# EAGLE design hexapod (EAGLE 6.4)
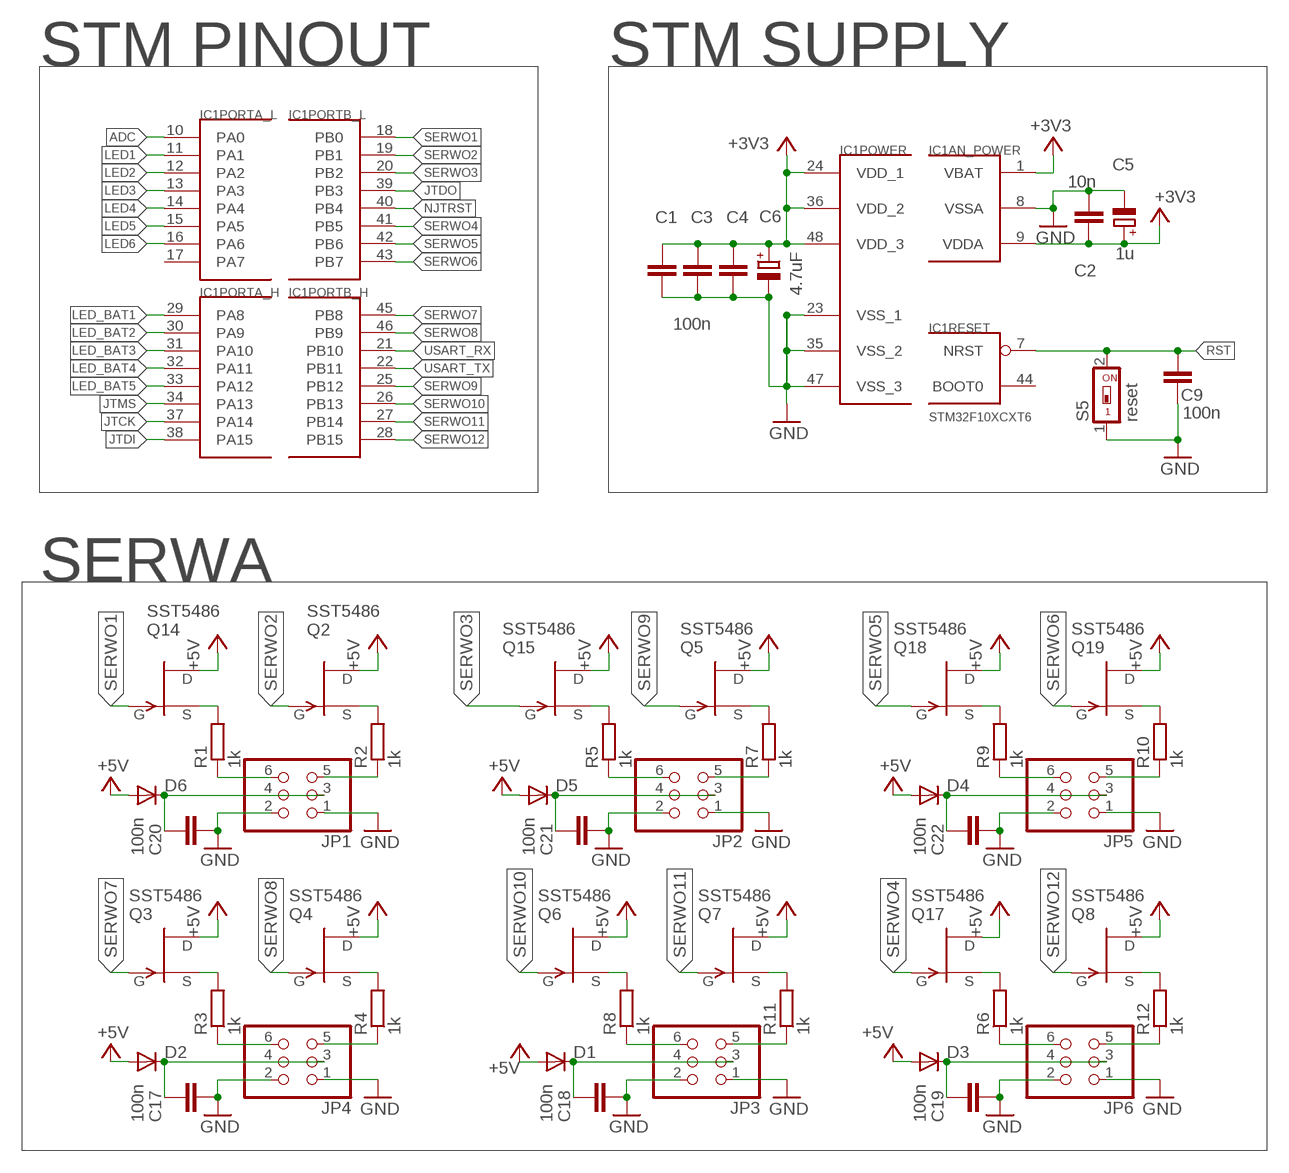
[diagram p0: schematic, sheet 1, part 1 of 2]
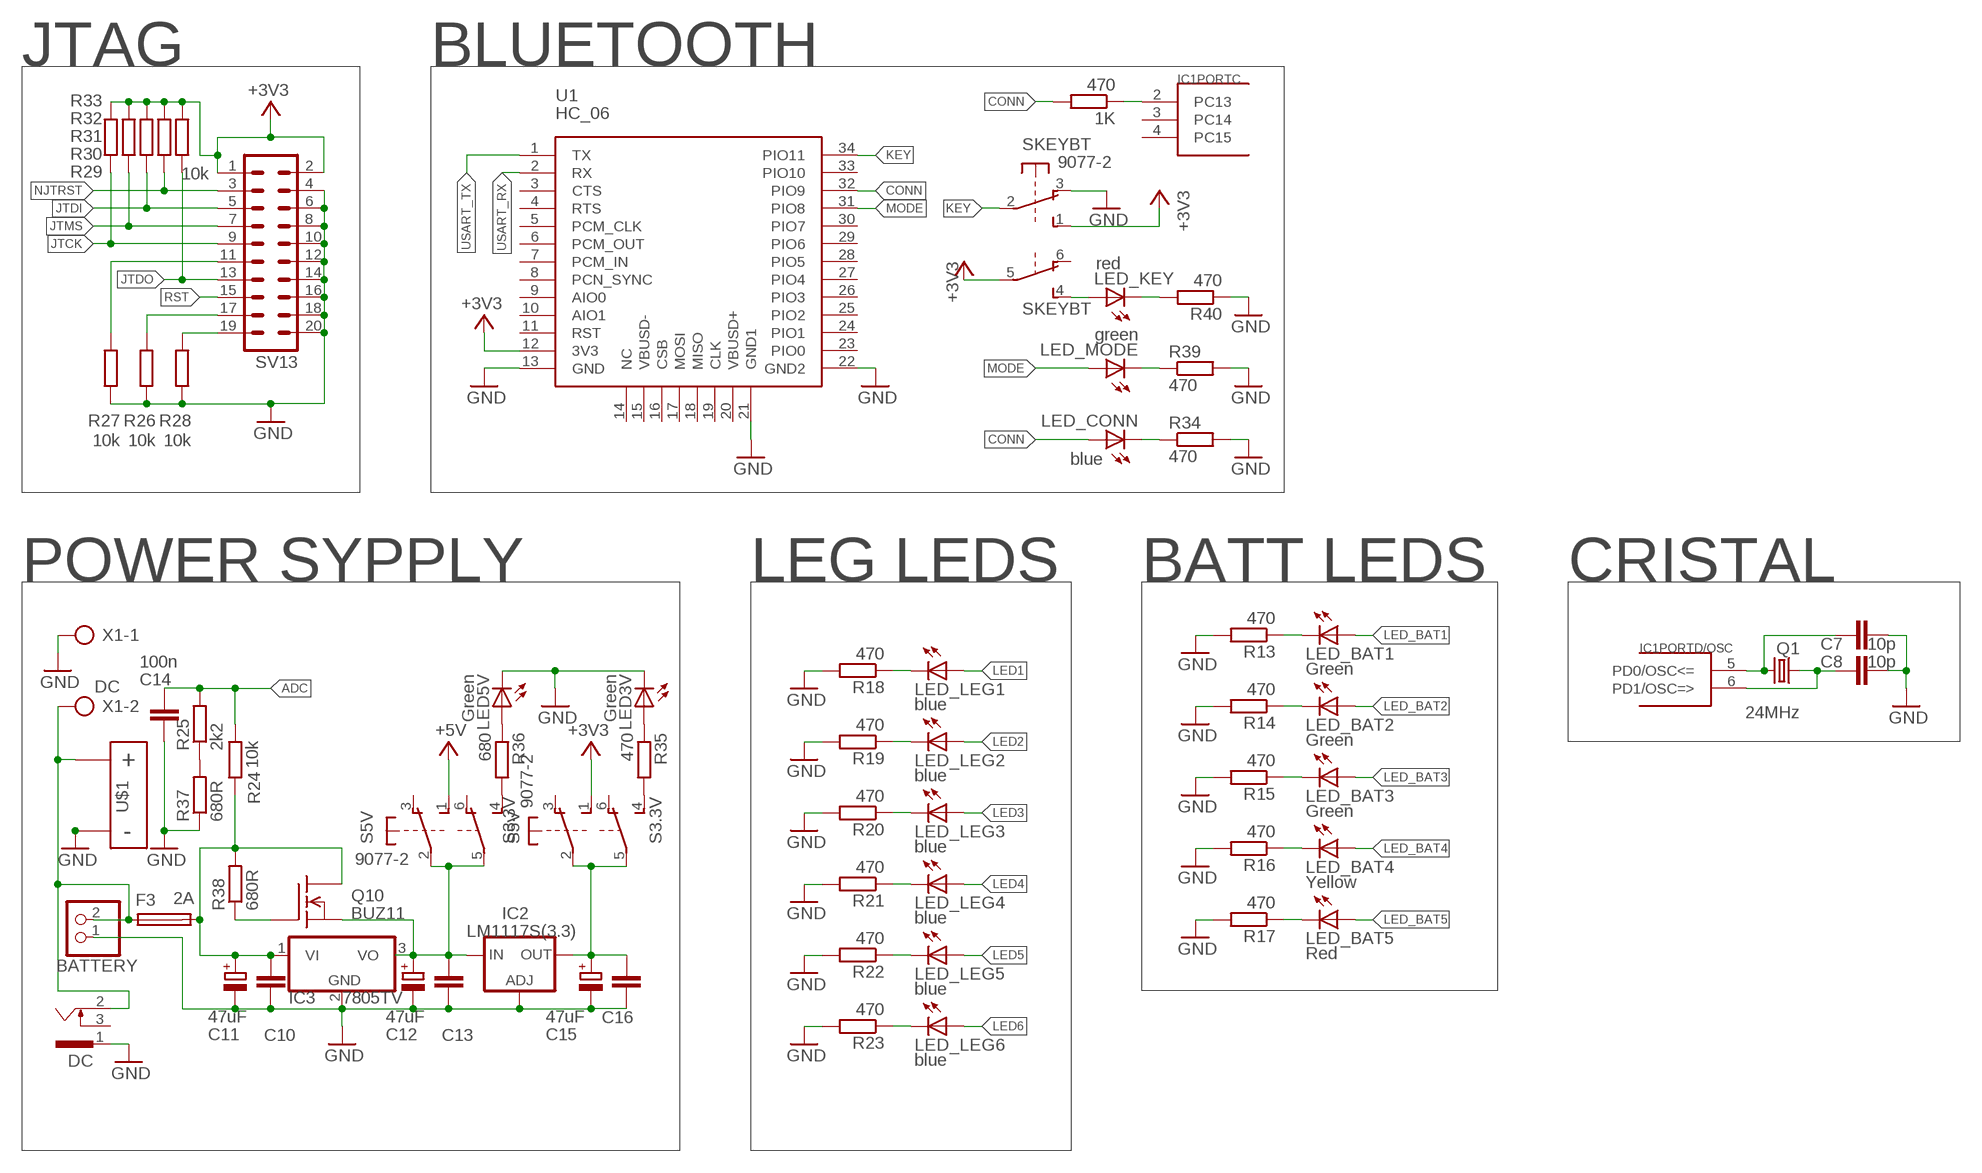
[diagram p1: schematic, sheet 1, part 2 of 2]

## Parts
1K  470  R-EU_M0805  [M0805]
BATTERY  PINHD-1X2  [1X02]
C1  100n  C-EUC0805K  [C0805K]
C2  10n  C-EUC0805K  [C0805K]
C3  100n  C-EUC0805K  [C0805K]
C4  100n  C-EUC0805K  [C0805K]
C5  1u  CPOL-EUE2.5-5  [E2,5-5]
C6  4.7uF  CPOL-EUE2.5-5  [E2,5-5]
C7  10p  C-EUC0805K  [C0805K]
C8  10p  C-EUC0805K  [C0805K]
C9  100n  C-EUC0805K  [C0805K]
C10  100n  C-EUC0805K  [C0805K]
C11  47uF  CPOL-EUE2.5-5  [E2,5-5]
C12  47uF  CPOL-EUE2.5-5  [E2,5-5]
C13  100n  C-EUC0805K  [C0805K]
C14  100n  C-EUC0805K  [C0805K]
C15  47uF  CPOL-EUE2.5-5  [E2,5-5]
C16  100n  C-EUC0805K  [C0805K]
C17  100n  C-EUC0805K  [C0805K]
C18  100n  C-EUC0805K  [C0805K]
C19  100n  C-EUC0805K  [C0805K]
C20  100n  C-EUC0805K  [C0805K]
C21  100n  C-EUC0805K  [C0805K]
C22  100n  C-EUC0805K  [C0805K]
D1  DIODE-DO-214AC  [DO-214AC]
D2  DIODE-DO-214AC  [DO-214AC]
D3  DIODE-DO-214AC  [DO-214AC]
D4  DIODE-DO-214AC  [DO-214AC]
D5  DIODE-DO-214AC  [DO-214AC]
D6  DIODE-DO-214AC  [DO-214AC]
DC  733980-62  [733980-62]
F3  2A  SH22,5  [SH22,5]
IC1  STM32F10XCXT6  [TQFP48]
IC2  LM1117S(3.3)  LM317MSTT3  [SOT223]
IC3  7805TV  [TO220V]
JP1  PINHD-2X3  [2X03]
JP2  PINHD-2X3  [2X03]
JP3  PINHD-2X3  [2X03]
JP4  PINHD-2X3  [2X03]
JP5  PINHD-2X3  [2X03]
JP6  PINHD-2X3  [2X03]
LED3V  Green  LEDCHIP-LED0805  [CHIP-LED0805]
LED5V  Green  LEDCHIP-LED0805  [CHIP-LED0805]
LED_BAT1  Green  LEDCHIP-LED0805  [CHIP-LED0805]
LED_BAT2  Green  LEDCHIP-LED0805  [CHIP-LED0805]
LED_BAT3  Green  LEDCHIP-LED0805  [CHIP-LED0805]
LED_BAT4  Yellow  LEDCHIP-LED0805  [CHIP-LED0805]
LED_BAT5  Red  LEDCHIP-LED0805  [CHIP-LED0805]
LED_CONN  blue  LEDCHIP-LED0805  [CHIP-LED0805]
LED_KEY  red  LEDCHIP-LED0805  [CHIP-LED0805]
LED_LEG1  blue  LEDCHIP-LED0805  [CHIP-LED0805]
LED_LEG2  blue  LEDCHIP-LED0805  [CHIP-LED0805]
LED_LEG3  blue  LEDCHIP-LED0805  [CHIP-LED0805]
LED_LEG4  blue  LEDCHIP-LED0805  [CHIP-LED0805]
LED_LEG5  blue  LEDCHIP-LED0805  [CHIP-LED0805]
LED_LEG6  blue  LEDCHIP-LED0805  [CHIP-LED0805]
LED_MODE  green  LEDCHIP-LED0805  [CHIP-LED0805]
Q1  24MHz  CRYSTALSM49  [SM49]
Q2  SST5486  [SOT23]
Q3  SST5486  [SOT23]
Q4  SST5486  [SOT23]
Q5  SST5486  [SOT23]
Q6  SST5486  [SOT23]
Q7  SST5486  [SOT23]
Q8  SST5486  [SOT23]
Q10  BUZ11  [TO220]
Q14  SST5486  [SOT23]
Q15  SST5486  [SOT23]
Q17  SST5486  [SOT23]
Q18  SST5486  [SOT23]
Q19  SST5486  [SOT23]
R1  1k  R-EU_M0805  [M0805]
R2  1k  R-EU_M0805  [M0805]
R3  1k  R-EU_M0805  [M0805]
R4  1k  R-EU_M0805  [M0805]
R5  1k  R-EU_M0805  [M0805]
R6  1k  R-EU_M0805  [M0805]
R7  1k  R-EU_M0805  [M0805]
R8  1k  R-EU_M0805  [M0805]
R9  1k  R-EU_M0805  [M0805]
R10  1k  R-EU_M0805  [M0805]
R11  1k  R-EU_M0805  [M0805]
R12  1k  R-EU_M0805  [M0805]
R13  470  R-EU_M0805  [M0805]
R14  470  R-EU_M0805  [M0805]
R15  470  R-EU_M0805  [M0805]
R16  470  R-EU_M0805  [M0805]
R17  470  R-EU_M0805  [M0805]
R18  470  R-EU_M0805  [M0805]
R19  470  R-EU_M0805  [M0805]
R20  470  R-EU_M0805  [M0805]
R21  470  R-EU_M0805  [M0805]
R22  470  R-EU_M0805  [M0805]
R23  470  R-EU_M0805  [M0805]
R24  10k  R-EU_M0805  [M0805]
R25  2k2  R-EU_M0805  [M0805]
R26  10k  R-EU_M0805  [M0805]
R27  10k  R-EU_M0805  [M0805]
R28  10k  R-EU_M0805  [M0805]
R29  10k  R-EU_M0805  [M0805]
R30  10k  R-EU_M0805  [M0805]
R31  10k  R-EU_M0805  [M0805]
R32  10k  R-EU_M0805  [M0805]
R33  10k  R-EU_M0805  [M0805]
R34  470  R-EU_M0805  [M0805]
R35  470  R-EU_M0805  [M0805]
R36  680  R-EU_M0805  [M0805]
R37  680R  R-EU_M0805  [M0805]
R38  680R  R-EU_M0805  [M0805]
R39  470  R-EU_M0805  [M0805]
R40  470  R-EU_M0805  [M0805]
S3.3V  9077-2  [9077-2]
S5  reset  SWS001  [SMS-001]
S5V  9077-2  [9077-2]
SKEYBT  9077-2  [9077-2]
SV13  ML20  [ML20]
U1  HC_06  HC_05  [BLUETOOTH_SMD]
U$1  DEANS.MALE  [DEANSM]
X1  DC  AK500/2  [AK500/2]

## Nets
+3V3: C1.1 C2.1 C3.1 C4.1 C5.+ C6.+ IC1.1(AN_POWER:VBAT) IC1.9(AN_POWER:VDDA) IC1.24(POWER:VDD_1) IC1.36(POWER:VDD_2) IC1.48(POWER:VDD_3) R29.2 R30.2 R31.2 R32.2 R33.2 S3.3V.1(1:S) SKEYBT.1(1:S) SKEYBT.5(2:P) SV13.1 SV13.2 U1.12(3V3)
+5V: D1.A D2.A D3.A D4.A D5.A D6.A Q2.1(D) Q3.1(D) Q4.1(D) Q5.1(D) Q6.1(D) Q7.1(D) Q8.1(D) Q14.1(D) Q15.1(D) Q17.1(D) Q18.1(D) Q19.1(D) S5V.1(1:S)
ADC: C14.1 IC1.10(PORTA_L:PA0) R24.1 R25.2
CONN: 1K.2 LED_CONN.A U1.32(PIO9)
GND: BATTERY.1 C1.2 C2.2 C3.2 C4.2 C5.- C6.- C7.2 C8.2 C9.1 C10.2 C11.- C12.- C13.2 C14.2 C15.- C16.2 C17.2 C18.2 C19.2 C20.2 C21.2 C22.2 DC.1 IC1.8(AN_POWER:VSSA) IC1.23(POWER:VSS_1) IC1.35(POWER:VSS_2) IC1.47(POWER:VSS_3) IC2.1(ADJ) IC3.2(GND) JP1.1 JP1.2 JP2.1 JP2.2 JP3.1 JP3.2 JP4.1 JP4.2 JP5.1 JP5.2 JP6.1 JP6.2 LED3V.C LED5V.C R13.2 R14.2 R15.2 R16.2 R17.2 R18.2 R19.2 R20.2 R21.2 R22.2 R23.2 R26.1 R27.1 R28.1 R34.2 R37.1 R39.2 R40.1 S5.1 SKEYBT.3(1:O) SV13.4 SV13.6 SV13.8 SV13.10 SV13.12 SV13.14 SV13.16 SV13.18 SV13.20 U1.13(GND) U1.21(GND1) U1.22(GND2) U$1.P$NEG X1.1
JTCK: IC1.37(PORTA_H:PA14) R29.1 SV13.9
JTDI: IC1.38(PORTA_H:PA15) R31.1 SV13.5
JTDO: IC1.39(PORTB_L:PB3) R33.1 SV13.13
JTMS: IC1.34(PORTA_H:PA13) R30.1 SV13.7
KEY: SKEYBT.2(1:P) U1.34(PIO11)
LED1: IC1.11(PORTA_L:PA1) LED_LEG1.A
LED2: IC1.12(PORTA_L:PA2) LED_LEG2.A
LED3: IC1.13(PORTA_L:PA3) LED_LEG3.A
LED4: IC1.14(PORTA_L:PA4) LED_LEG4.A
LED5: IC1.15(PORTA_L:PA5) LED_LEG5.A
LED6: IC1.16(PORTA_L:PA6) LED_LEG6.A
LED_BAT1: IC1.29(PORTA_H:PA8) LED_BAT1.A
LED_BAT2: IC1.30(PORTA_H:PA9) LED_BAT2.A
LED_BAT3: IC1.31(PORTA_H:PA10) LED_BAT3.A
LED_BAT4: IC1.32(PORTA_H:PA11) LED_BAT4.A
LED_BAT5: IC1.33(PORTA_H:PA12) LED_BAT5.A
MODE: LED_MODE.A U1.31(PIO8)
N$1: C7.1 IC1.5(PORTD/OSC:PD0/OSC<=) Q1.2
N$2: C8.1 IC1.6(PORTD/OSC:PD1/OSC=>) Q1.1
N$3: 1K.1 IC1.2(PORTC:PC13)
N$4: Q14.2(S) R1.2
N$5: JP5.5 R10.1
N$6: Q2.2(S) R2.2
N$7: JP3.5 R11.1
N$8: JP5.6 R9.1
N$9: JP3.6 R8.1
N$10: R25.1 R37.2
N$11: JP6.5 R12.1
N$12: Q15.2(S) R5.2
N$13: JP2.5 R7.1
N$14: Q18.2(S) R9.2
N$15: JP2.6 R5.1
N$16: JP6.6 R6.1
N$17: JP1.6 R1.1
N$18: JP4.6 R3.1
N$19: JP4.5 R4.1
N$20: Q19.2(S) R10.2
N$21: JP1.5 R2.1
N$22: R36.2 S5V.4(2:S)
N$23: C10.1 C11.+ F3.2 IC3.1(VI) Q10.2(D) R24.2 R38.2
N$24: Q10.1(G) R38.1
N$25: LED_MODE.C R39.1
N$26: LED_KEY.A SKEYBT.4(2:S)
N$27: LED_KEY.C R40.2
N$28: LED_BAT1.C R13.1
N$29: LED_LEG1.C R18.1
N$30: LED_BAT2.C R14.1
N$31: LED_LEG2.C R19.1
N$32: LED_BAT3.C R15.1
N$33: LED_LEG3.C R20.1
N$34: LED_BAT4.C R16.1
N$35: LED_LEG4.C R21.1
N$36: LED_BAT5.C R17.1
N$37: LED_LEG5.C R22.1
N$38: LED_LEG6.C R23.1
N$39: C18.1 D1.C JP3.3 JP3.4
N$40: LED_CONN.C R34.1
N$41: C15.+ C16.1 IC2.4(OUT) S3.3V.2(1:P) S3.3V.5(2:P)
N$42: C12.+ C13.1 IC2.3(IN) IC3.3(VO) Q10.3(S) S5V.2(1:P) S5V.5(2:P)
N$43: Q17.2(S) R6.2
N$44: R27.2 SV13.11
N$45: Q3.2(S) R3.2
N$46: R35.2 S3.3V.4(2:S)
N$47: R26.2 SV13.17
N$48: R28.2 SV13.19
N$49: LED3V.A R35.1
N$50: C17.1 D2.C JP4.3 JP4.4
N$51: LED5V.A R36.1
N$52: BATTERY.2 DC.2 F3.1 U$1.P$POS X1.2
N$53: Q4.2(S) R4.2
N$54: Q5.2(S) R7.2
N$55: Q6.2(S) R8.2
N$56: Q7.2(S) R11.2
N$57: Q8.2(S) R12.2
N$58: C19.1 D3.C JP6.3 JP6.4
N$59: C22.1 D4.C JP5.3 JP5.4
N$60: C21.1 D5.C JP2.3 JP2.4
N$61: C20.1 D6.C JP1.3 JP1.4
NJTRST: IC1.40(PORTB_L:PB4) R32.1 SV13.3
RST: C9.2 IC1.7(RESET:NRST) S5.2 SV13.15
SERWO1: IC1.18(PORTB_L:PB0) Q14.3(G)
SERWO2: IC1.19(PORTB_L:PB1) Q2.3(G)
SERWO3: IC1.20(PORTB_L:PB2) Q15.3(G)
SERWO4: IC1.41(PORTB_L:PB5) Q17.3(G)
SERWO5: IC1.42(PORTB_L:PB6) Q18.3(G)
SERWO6: IC1.43(PORTB_L:PB7) Q19.3(G)
SERWO7: IC1.45(PORTB_H:PB8) Q3.3(G)
SERWO8: IC1.46(PORTB_H:PB9) Q4.3(G)
SERWO9: IC1.25(PORTB_H:PB12) Q5.3(G)
SERWO10: IC1.26(PORTB_H:PB13) Q6.3(G)
SERWO11: IC1.27(PORTB_H:PB14) Q7.3(G)
SERWO12: IC1.28(PORTB_H:PB15) Q8.3(G)
USART_RX: IC1.21(PORTB_H:PB10) U1.2(RX)
USART_TX: IC1.22(PORTB_H:PB11) U1.1(TX)
Unconnected: DC.3 IC1.3(PORTC:PC14) IC1.4(PORTC:PC15) IC1.17(PORTA_L:PA7) IC1.44(RESET:BOOT0) S3.3V.3(1:O) S3.3V.6(2:O) S5V.3(1:O) S5V.6(2:O) SKEYBT.6(2:O) U1.3(CTS) U1.4(RTS) U1.5(PCM_CLK) U1.6(PCM_OUT) U1.7(PCM_IN) U1.8(PCN_SYNC) U1.9(AIO0) U1.10(AIO1) U1.11(RST) U1.14(NC) U1.15(VBUSD-) U1.16(CSB) U1.17(MOSI) U1.18(MISO) U1.19(CLK) U1.20(VBUSD+) U1.23(PIO0) U1.24(PIO1) U1.25(PIO2) U1.26(PIO3) U1.27(PIO4) U1.28(PIO5) U1.29(PIO6) U1.30(PIO7) U1.33(PIO10)

## Notes on the sheet
- STM PINOUT | STM SUPPLY | JTAG | BLUETOOTH
- SERWA | POWER SYPPLY | LEG LEDS | BATT LEDS | CRISTAL

## Library data of the parts
1K R1-R40 = resistor:R-EU_: RESISTOR, European symbol
BATTERY = pinhead:PINHD-1X2: PIN HEADER
C1-C4 C7-C10 C13 C14 C16-C22 = rcl:C-EU: CAPACITOR, European symbol
C5 C6 C11 C12 C15 = rcl:CPOL-EU: POLARIZED CAPACITOR, European symbol
D1-D6 = diode:DIODE-: DIODE
DC = con-conrad:73398?: FEMALE PRINT CONNECTOR Niedervolt-Steckverbinder Distributor Conrad
F3 = fuse:SH22,5: FUSE HOLDER grid 22,5 mm, OGN0031 8201, Schurter (Buerklin); MF: SCHURTER; MPN: 0031.8201; OC_FARNELL: 1162740; OC_NEWARK: 96F8317
IC1 = stm32:STM32F10XCXT6: ST STM32F101/103 48pin LQFP
IC2 = v-reg:LM317?*: 500 mA Adjustable Output Positive Voltage Regulator Source: http://www.onsemi.co.jp .. LM317M-D.PDF
IC3 = linear:78*: Positive VOLTAGE REGULATOR Source: http://cache.national.com/ds/LM/LM78L05.pdf http://www.fairchildsemi.com/ds/LM/LM7805.pdf
JP1-JP6 = pinhead:PINHD-2X3: PIN HEADER
LED3V LED5V LED_BAT1-LED_BAT5 LED_CONN LED_KEY LED_LEG1-LED_LEG6 LED_MODE = led:LED: LED OSRAM: - CHIPLED LG R971, LG N971, LY N971, LG Q971, LY Q971, LO R971, LY R971 LH N974, LH R974 LS Q976, LO Q976, LY Q976 LO Q996 - Hyper CHIPLED LW Q18S LB Q993, LB Q99A, LB R99A - SideLED LS A670, LO A670, LY A670, LG A670, LP A670 LB A673, LV A673, LT A673, LW A673 LH A674 LY A675 LS A676, LA A676, LO A676, LY A676, LW A676 LS A679, LY A679, LG A679 - Hyper Micro SIDELED® LS Y876, LA Y876, LO Y876, LY Y876 LT Y87S - SmartLED LW L88C, LW L88S LB L89C, LB L89S, LG L890 LS L89K, LO L89K, LY L89K LS L896, LA L896, LO L896, LY L896 - TOPLED LS T670, LO T670, LY T670, LG T670, LP T670 LSG T670, LSP T670, LSY T670, LOP T670, LYG T670 LG T671, LOG T671, LSG T671 LB T673, LV T673, LT T673, LW T673 LH T674 LS T676, LA T676, LO T676, LY T676, LB T676, LH T676, LSB T676, LW T676 LB T67C, LV T67C, LT T67C, LS T67K, LO T67K, LY T67K, LW E67C LS E67B, LA E67B, LO E67B, LY E67B, LB E67C, LV E67C, LT E67C LW T67C LS T679, LY T679, LG T679 LS T770, LO T770, LY T770, LG T770, LP T770 LB T773, LV T773, LT T773, LW T773 LH T774 LS E675, LA E675, LY E675, LS T675 LS T776, LA T776, LO T776, LY T776, LB T776 LHGB T686 LT T68C, LB T68C - Hyper Mini TOPLED® LB M676 - Mini TOPLED Santana® LG M470 LS M47K, LO M47K, LY M47K Source: http://www.osram.convergy.de LUXEON: - LUMILED® LXK2-PW12-R00, LXK2-PW12-S00, LXK2-PW14-U00, LXK2-PW14-V00 LXK2-PM12-R00, LXK2-PM12-S00, LXK2-PM14-U00 LXK2-PE12-Q00, LXK2-PE12-R00, LXK2-PE12-S00, LXK2-PE14-T00, LXK2-PE14-U00 LXK2-PB12-K00, LXK2-PB12-L00, LXK2-PB12-M00, LXK2-PB14-N00, LXK2-PB14-P00, LXK2-PB14-Q00 LXK2-PR12-L00, LXK2-PR12-M00, LXK2-PR14-Q00, LXK2-PR14-R00 LXK2-PD12-Q00, LXK2-PD12-R00, LXK2-PD12-S00 LXK2-PH12-R00, LXK2-PH12-S00 LXK2-PL12-P00, LXK2-PL12-Q00, LXK2-PL12-R00 Source: www.luxeon.com KINGBRIGHT: KA-3528ASYC Source: www.kingbright.com
Q1 = crystal:CRYSTAL: CRYSTAL; OC_FARNELL: unknown; OC_NEWARK: unknown
Q2-Q8 Q14 Q15 Q17-Q19 = transistor-fet:?548*: N-Channel JFETs Source: VISHAY 2N5484.pdf Compatible: TO92 2N5245 J304 J305 U310 J308 J309 J310 TO72 2N4416 2N4416A 2N3823 2N4351 3N169 3N170 3N171 MFE3002 TO18 2N3796 2N3797 MFE825 Source: Motorola European Master Guide Pacge 3-59
Q10 = transistor-fet:BUZ11: N-Channel Enhancement MOSFET 50V; 30A; 0,040Ohm
S3.3V S5V SKEYBT = switch-misc:9077-2: MARQUARDT SWITCH 9077.0200 Distributor: Buerklin <https://www.buerklin.com/default.asp?event=ShowArtikel%2812G2822%29&l=d&jump=ArtNr_12G2822>
S5 = smd-special:SWS001: SMD Dip Switch 1 pol.
SV13 = con-harting-ml:ML20: HARTING; OC_FARNELL: unknown; OC_NEWARK: unknown
U1 = SerialPortBluetooth:HC_05
U$1 = bt_electromech:DEANS
X1 = con-ptr500:AK500/2: CONNECTOR; OC_FARNELL: unknown; OC_NEWARK: unknown

## Board
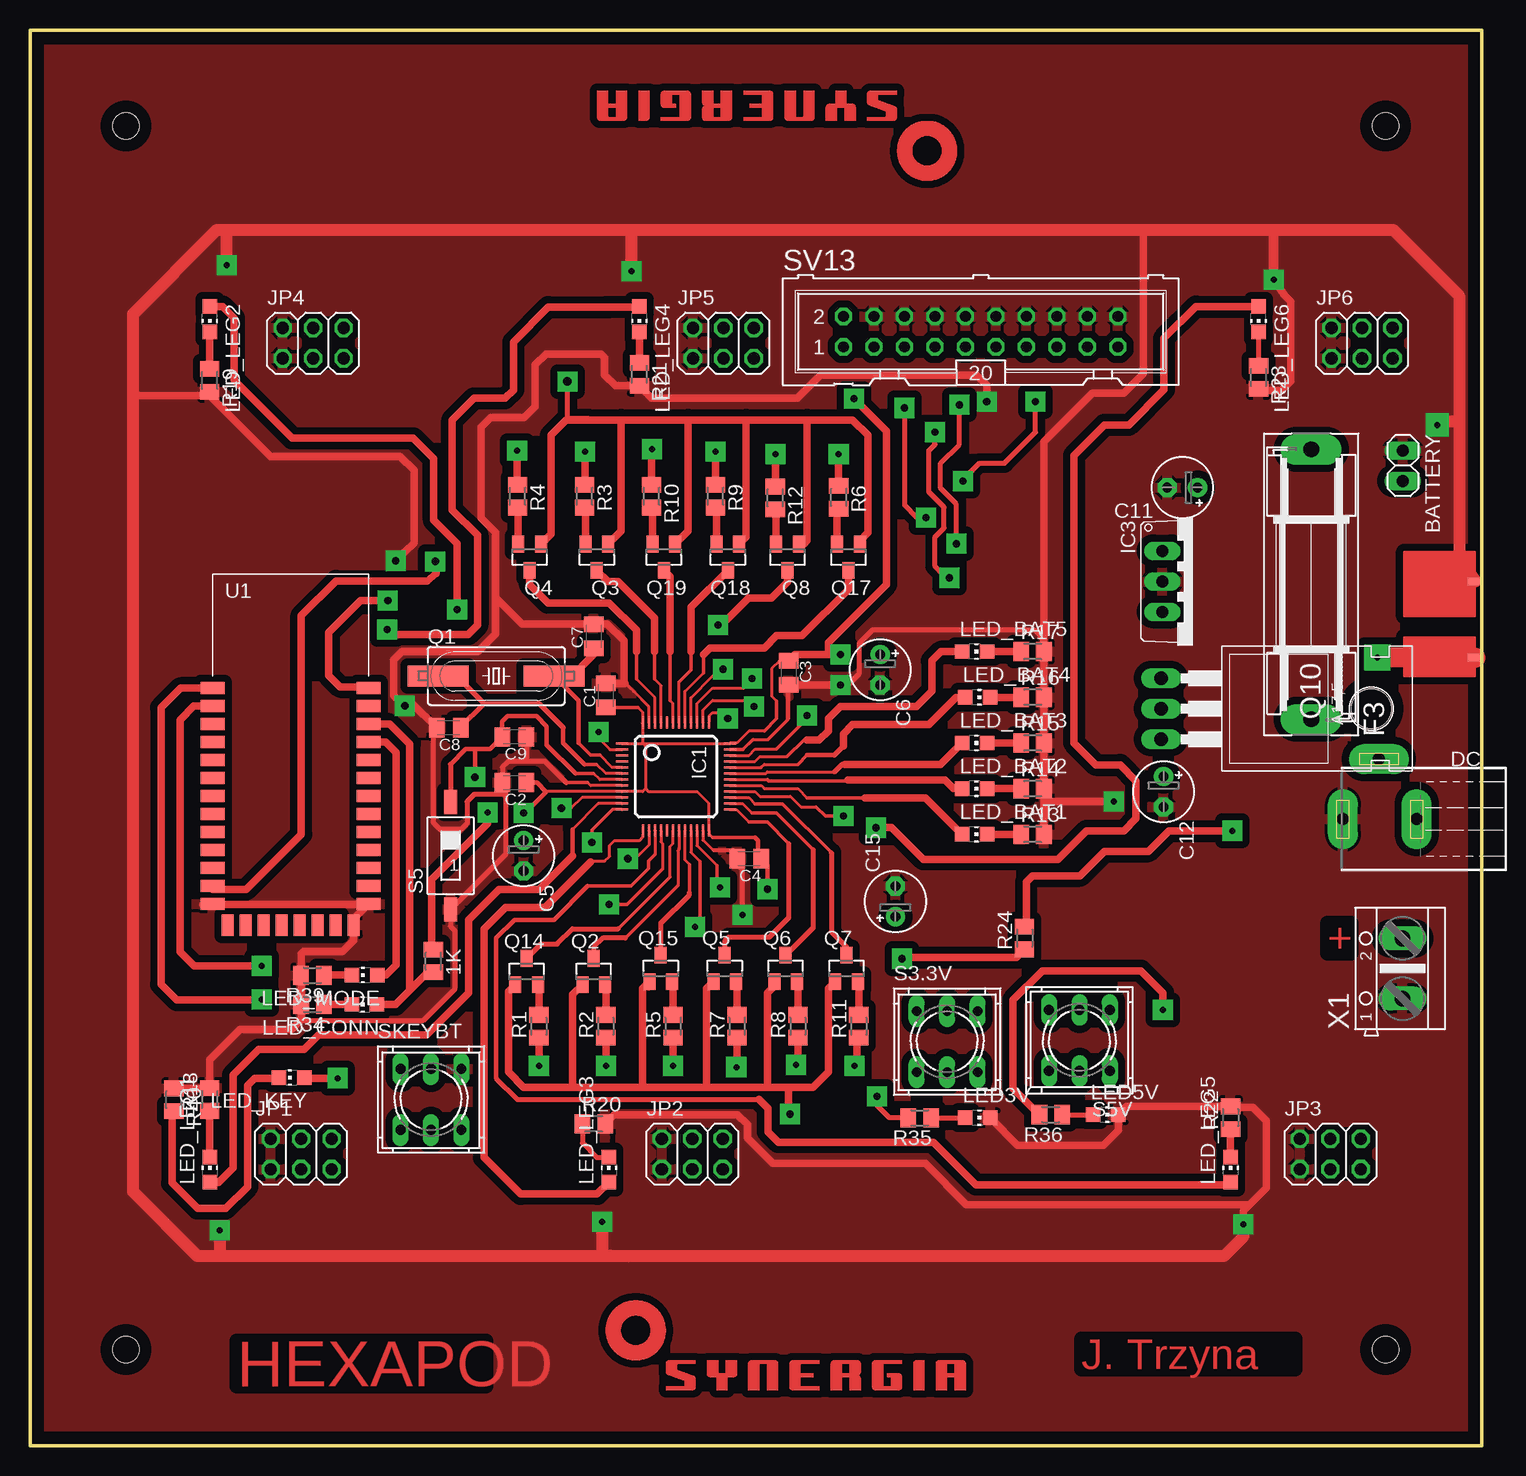
[diagram p2: board, top side]
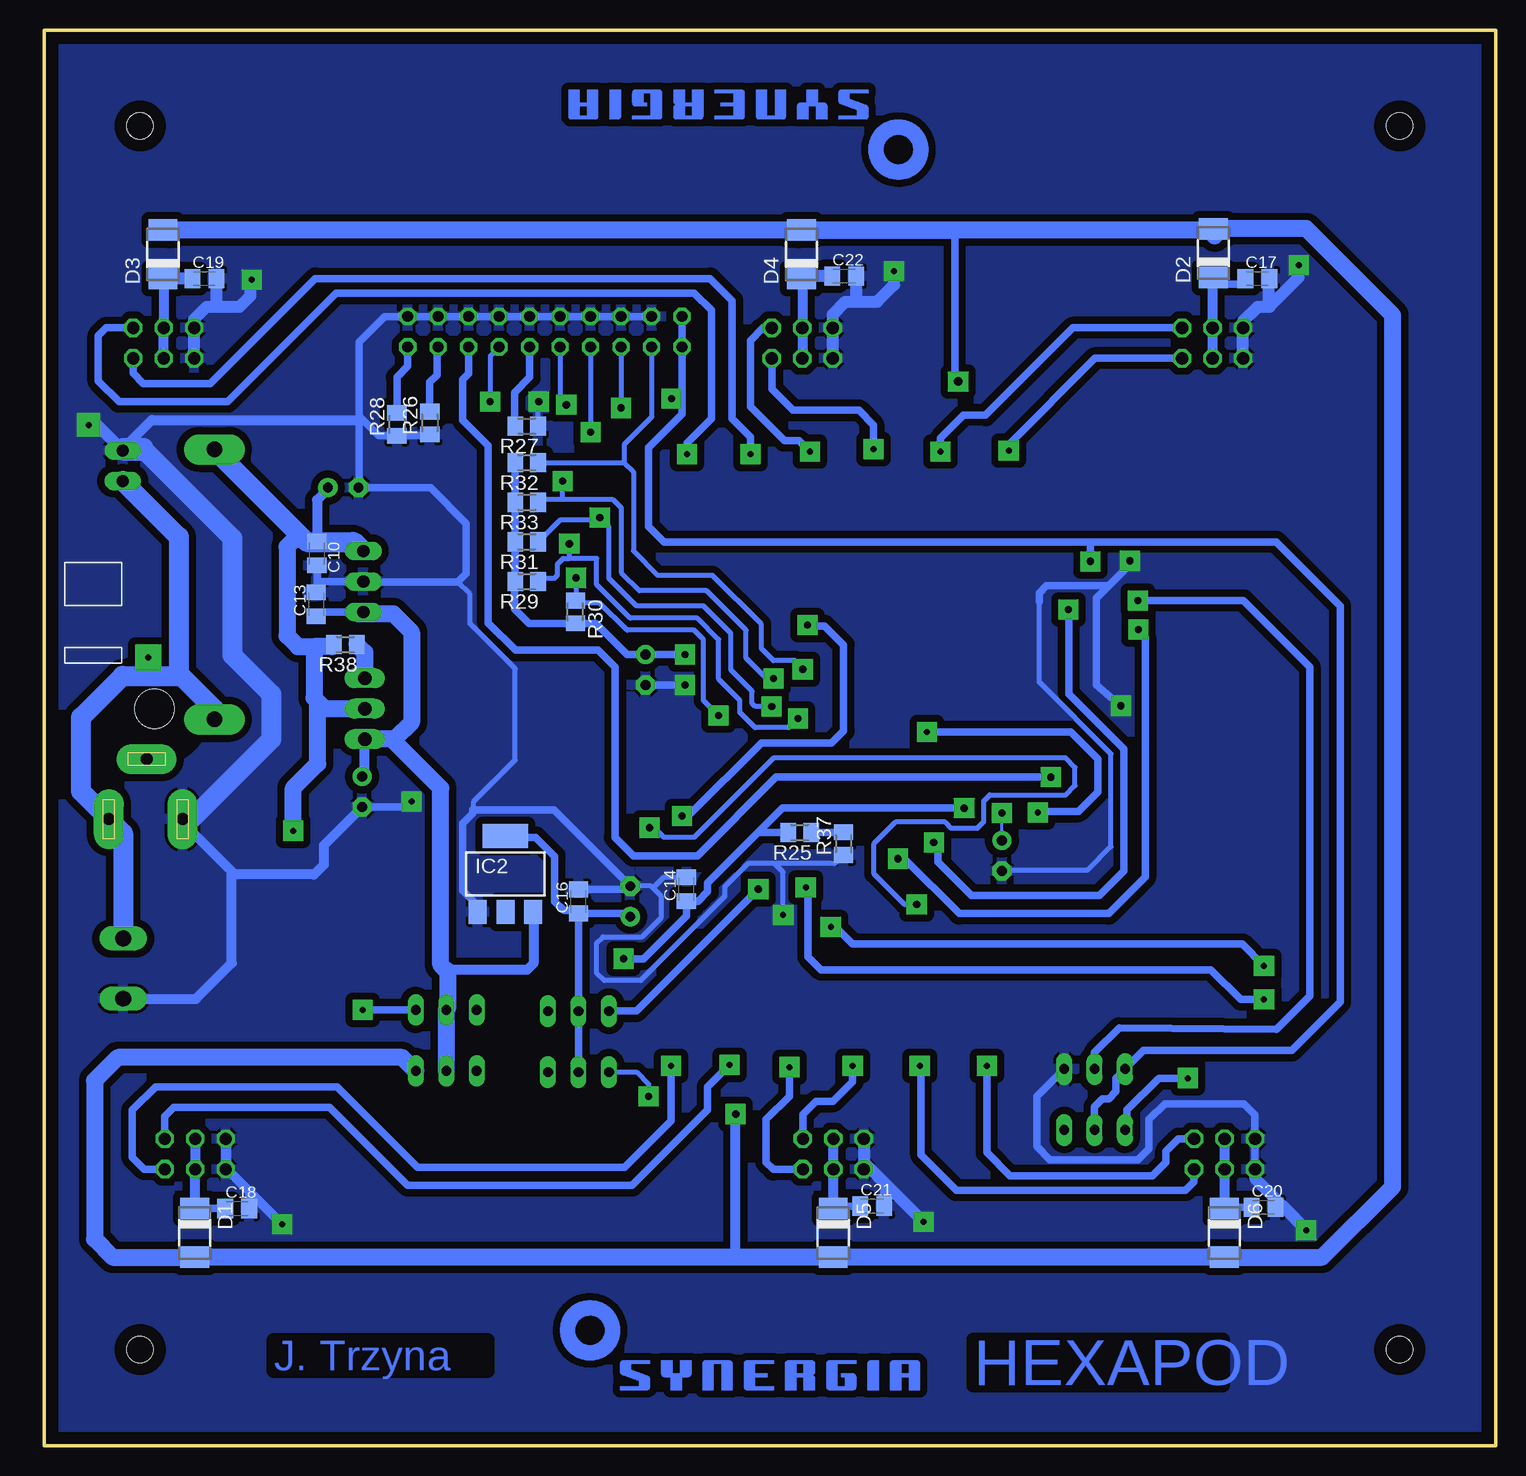
[diagram p3: board, bottom side, seen from below]

Size 121 x 118 mm. Coordinates in mm from the lower left corner, seen from the top.
Outline: 0,118 121,118 121,0 0,0 0,118
Copper layers (1*16): Top 0.035mm / dielectric 1.5mm / Bottom 0.035mm
Design rules "default": minimum track width 10mil, minimum drill 24mil, track to track 8mil, track to pad 8mil, pad to pad 8mil, via to via 8mil, smd to smd 8mil, copper to edge 40mil, drill to drill 8mil, minimum pad ring 10mil, minimum via ring 8mil, stop-mask expansion 4mil, vias tented up to drill 0mil, thermal gap 10mil
Holes 2.2 mm at 8,110 113,110 113,8 8,8

### Footprints (pad centres in the part's own frame; a part is rotated, then mirrored left to right if it is on the bottom)
M0805 = smd 1.3 x 1.6: 1 -0.95,0; 2 0.95,0
1X02 = drill 1.016 long: 1 -1.27,0; 2 1.27,0
C0805K = smd 1.3 x 1.6: 1 -1,0; 2 1,0
E2,5-5 = drill 0.813 pad 1.6: + -1.27,0 | drill 0.813 pad 1.6 octagon: - 1.27,0
DO-214AC = smd 1.8 x 2.4: A 2.025,0; C -2.025,0
733980-62 = drill 1 pad 2.5 long: 1 0,8.57; 2 0,2.42; 3 5,5.57
SH22,5 = drill 1.321 pad 2.54 long: 1 -11.252,0; 2 11.252,0
TQFP48 = smd 0.2 x 1: 1 -2.75,-4.5; 2 -2.25,-4.5; 3 -1.75,-4.5; 4 -1.25,-4.5; 5 -0.75,-4.5; 6 -0.25,-4.5; 7 0.25,-4.5; 8 0.75,-4.5; 9 1.25,-4.5; 10 1.75,-4.5; 11 2.25,-4.5; 12 2.75,-4.5; 25 2.75,4.5; 26 2.25,4.5; 27 1.75,4.5; 28 1.25,4.5; 29 0.75,4.5; 30 0.25,4.5; 31 -0.25,4.5; 32 -0.75,4.5; 33 -1.25,4.5; 34 -1.75,4.5; 35 -2.25,4.5; 36 -2.75,4.5 | smd 1 x 0.2: 13 4.5,-2.75; 14 4.5,-2.25; 15 4.5,-1.75; 16 4.5,-1.25; 17 4.5,-0.75; 18 4.5,-0.25; 19 4.5,0.25; 20 4.5,0.75; 21 4.5,1.25; 22 4.5,1.75; 23 4.5,2.25; 24 4.5,2.75; 37 -4.5,2.75; 38 -4.5,2.25; 39 -4.5,1.75; 40 -4.5,1.25; 41 -4.5,0.75; 42 -4.5,0.25; 43 -4.5,-0.25; 44 -4.5,-0.75; 45 -4.5,-1.25; 46 -4.5,-1.75; 47 -4.5,-2.25; 48 -4.5,-2.75
SOT223 = smd 1.5 x 2: 1 -2.3,-3.15; 2 0,-3.15; 3 2.3,-3.15 | smd 3.8 x 2: 4 0,3.15
TO220V = drill 1.016 long: 1 -2.54,-2.54; 2 0,-2.54; 3 2.54,-2.54
2X03 = drill 1.016 octagon: 1 -2.54,-1.27; 2 -2.54,1.27; 3 0,-1.27; 4 0,1.27; 5 2.54,-1.27; 6 2.54,1.27
CHIP-LED0805 = smd 1.2 x 1.2: A 0,-1.05; C 0,1.05
SM49 = smd 5.08 x 1.778: 1 -4.826,0; 2 4.826,0
SOT23 = smd 1 x 1.4: 1 -0.95,-1.1; 2 0.95,-1.1; 3 0,1.1
TO220 = drill 1.118 long: 1 -2.54,-6.35; 2 0,-6.35; 3 2.54,-6.35 | hole 3.302: 0,11.176
9077-2 = drill 0.813 long: 1 -2.54,2.54; 2 0,2.54; 3 2.54,2.54; 4 -2.54,-2.54; 5 0,-2.54; 6 2.54,-2.54
SMS-001 = smd 1.092 x 2.007: 1 0,-4.496; 2 0,4.496
ML20 = drill 0.914 octagon: 1 -11.43,-1.27; 2 -11.43,1.27; 3 -8.89,-1.27; 4 -8.89,1.27; 5 -6.35,-1.27; 6 -6.35,1.27; 7 -3.81,-1.27; 8 -3.81,1.27; 9 -1.27,-1.27; 10 -1.27,1.27; 11 1.27,-1.27; 12 1.27,1.27; 13 3.81,-1.27; 14 3.81,1.27; 15 6.35,-1.27; 16 6.35,1.27; 17 8.89,-1.27; 18 8.89,1.27; 19 11.43,-1.27; 20 11.43,1.27
BLUETOOTH_SMD = smd 2 x 1: 1 0,0; 2 0,-1.5; 3 0,-3; 4 0,-4.5; 5 0,-6; 6 0,-7.5; 7 0,-9; 8 0,-10.5; 9 0,-12; 10 0,-13.5; 11 0,-15; 12 0,-16.5; 13 0,-18; 22 13,-18; 23 13,-16.5; 24 13,-15; 25 13,-13.5; 26 13,-12; 27 13,-10.5; 28 13,-9; 29 13,-7.5; 30 13,-6; 31 13,-4.5; 32 13,-3; 33 13,-1.5; 34 13,0 | smd 1 x 1.8: 14 1.25,-19.75; 15 2.75,-19.75; 16 4.25,-19.75; 17 5.75,-19.75; 18 7.25,-19.75; 19 8.75,-19.75; 20 10.25,-19.75; 21 11.75,-19.75
DEANSM = smd 1.27 x 0.635: P$NEG 3.175,3.81; P$POS 3.175,-2.54
AK500/2 = drill 1.321 long: 1 -2.515,0; 2 2.515,0

### Placement (x,y rotation side)
1K  33.63,40.39 270 top
BATTERY  114.44,81.68 270 top
C1  48.01,62.53 90 top
C2  40.39,55.26 180 top
C3  63.25,64.41 270 top
C4  59.95,48.91 180 top
C5  41.15,49.17 270 top
C6  70.87,64.66 270 top
C7  46.99,67.45 90 top
C8  34.9,59.83 180 top
C9  40.39,59.07 180 top
C10  98.25,74.36 270 bottom
C11  96.07,79.85 180 top
C12  94.5,54.5 270 top
C13  98.32,70.12 90 bottom
C14  67.46,46.37 90 bottom
C15  72.14,45.36 90 top
C16  76.46,45.36 90 bottom
C17  19.86,97.27 0 bottom
C18  104.9,19.75 0 bottom
C19  107.65,97.27 0 bottom
C20  19.36,19.85 0 bottom
C21  51.97,19.96 0 bottom
C22  54.31,97.48 0 bottom
D1  108.46,17.72 270 bottom
D2  23.52,99.41 90 bottom
D3  111.1,99.31 90 bottom
D4  57.86,99.31 90 bottom
D5  55.22,17.72 270 bottom
D6  22.61,17.72 270 bottom
DC  118.02,52.21 90 top
F3  106.81,71.79 90 top
IC1  53.85,55.77 270 top
IC2  82.55,47.64 0 bottom
IC3  96.93,72.03 270 top
JP1  22.6,24.3 0 top
JP2  55.21,24.3 0 top
JP3  108.4,24.3 0 top
JP4  23.6,91.9 0 top
JP5  57.8,91.9 0 top
JP6  111.04,91.9 0 top
LED3V  79,27.32 270 top
LED5V  89.66,27.58 270 top
LED_BAT1  78.74,50.94 270 top
LED_BAT2  78.74,54.75 270 top
LED_BAT3  78.74,58.56 270 top
LED_BAT4  79,62.37 270 top
LED_BAT5  78.74,66.18 270 top
LED_CONN  27.88,36.77 90 top
LED_KEY  21.81,30.68 90 top
LED_LEG1  14.99,23 0 top
LED_LEG2  14.99,93.9 180 top
LED_LEG3  48.26,23 0 top
LED_LEG4  50.8,93.9 180 top
LED_LEG5  100.08,23 0 top
LED_LEG6  102.41,93.9 180 top
LED_MODE  27.9,39.22 90 top
Q1  38.86,64.15 0 top
Q2  46.99,39.51 0 top
Q3  47.25,74.06 180 top
Q4  41.66,74.06 180 top
Q5  57.91,39.77 0 top
Q6  62.99,39.77 0 top
Q7  68.07,39.77 0 top
Q8  63.15,74.06 180 top
Q10  100.63,61.42 270 top
Q14  41.4,39.51 0 top
Q15  52.58,39.77 0 top
Q17  68.23,74.06 180 top
Q18  58.17,74.06 180 top
Q19  52.83,74.06 180 top
R1  42.42,34.94 90 top
R2  48.01,34.94 90 top
R3  46.23,79.14 270 top
R4  40.64,79.14 270 top
R5  53.6,34.94 90 top
R6  67.41,79.04 270 top
R7  58.93,34.94 90 top
R8  64.01,34.94 90 top
R9  57.15,79.14 270 top
R10  51.82,79.14 270 top
R11  69.09,34.94 90 top
R12  62.13,78.99 270 top
R13  83.57,50.94 0 top
R14  83.57,54.75 0 top
R15  83.57,58.56 0 top
R16  83.57,62.37 0 top
R17  83.57,66.18 0 top
R18  14.99,28.85 90 top
R19  14.99,88.79 270 top
R20  46.99,26.81 0 top
R21  50.8,89.3 270 top
R22  100.08,27.32 90 top
R23  102.41,89.04 270 top
R24  82.91,42.31 90 top
R25  58.02,51.1 180 bottom
R26  88.85,85.23 90 bottom
R27  80.77,84.98 180 bottom
R28  91.59,85.13 90 bottom
R29  80.77,72.03 180 bottom
R30  76.71,69.49 270 bottom
R31  80.77,75.33 180 bottom
R32  80.77,81.93 180 bottom
R33  80.77,78.63 180 bottom
R34  23.56,36.77 180 top
R35  74.17,27.32 180 top
R36  85.09,27.58 180 top
R37  54.36,50.18 90 bottom
R38  95.88,66.77 180 bottom
R39  23.55,39.19 180 top
R40  12,28.82 270 top
S3.3V  76.46,33.67 0 top
S5  35.05,49.17 0 top
S5V  87.48,33.77 180 top
SKEYBT  33.43,28.85 0 top
SV13  79.25,92.85 0 top
U1  15.24,63.14 0 top
U$1  117.33,68.22 0 top
U$2  [SYNERGIA_30MM]  48.01,4.61 0 top
U$3  [SYNERGIA_30MM]  77.27,112.92 180 top
U$4  [SYNERGIA_30MM]  47.3,113.02 180 bottom
U$5  [SYNERGIA_30MM]  77.98,4.61 0 bottom
X1  114.41,39.77 90 top

### Tracks (layer width: path | path; a pad name or v marks a point on that pad's centre or on a via)
+3V3  (via drill 0.6 pad 1.68)
  Top 0.254: v41.15,52.72 41.26,52.72 | 51.1,58.52 IC1.36 58.39,58.56 58.93,58.56 59.95,59.58 61.22,59.58 | IC1.1 51.06,58.52 | 51.06,58.52 51.1,58.52 | 51.1,58.52 51.31,58.31 51.31,54.75 | 51.31,54.75 51.08,54.52 IC1.9 42.99,54.52 43.07,54.5 43.04,54.5 | 51.06,58.52 51.06,60.23 IC1.48 51.1,61.11 50.68,61.53 | C3.1 62.47,65.41 61.83,64.76 61.83,62.48 62.23,62.07 | C4.1 60.71,49.66 60.71,48.66 61.22,48.66 61.47,48.4 | 56.9,50.69 56.6,50.99 IC1.24 56.6,53.53 55.63,54.5 51.56,54.5 51.31,54.75
  Top 0.305: 50.68,61.53 C1.1 | 62.23,62.07 62.23,60.6 61.22,59.58 | 56.9,50.69 60.45,50.69
  Top 0.356: 41.26,52.72 43.04,54.5 42.27,55.26 C2.1 | 60.71,49.66 60.71,50.44 60.45,50.69 | 61.47,48.4 v61.47,46.37
  Top 0.61: 66.55,65.93 63.77,65.93 C3.1 | U1.12 15.23,46.63 14.99,46.63 15.24,46.37 18.04,46.37 22.61,50.94 22.61,69.18 25.5,72.08 33.12,72.08 33.84,72.69 v33.78,73.7 | v67.57,65.93 66.55,65.93 | 66.55,65.93 66.55,66.95 71.38,71.77 71.38,84.58 v68.69,87.27
  Bottom 0.254: C5.+ v41.15,52.72
  Bottom 0.61: SV13.2 SV13.1 67.82,87.52 | v33.78,73.7 33.78,75.33 | 33.78,75.33 69.34,75.33 70.61,76.6 70.61,83.2 67.82,86 67.82,87.52 | 33.78,75.33 18.29,75.33 12.96,69.99 12.96,36.97 17,32.93 29.35,32.93 SKEYBT.1 31.65,30.62 31.65,29.51 32.26,28.9 32.77,28.9 33.43,28.24 SKEYBT.5 | S3.3V.1 71.63,36.21 v61.47,46.37 | R32.2 R33.2 R31.2 R29.2 81.79,71.96 81.79,69.74 80.59,68.54 R30.2 75,68.54 72.39,65.93 C6.+ v67.57,65.93 | v68.69,87.27 68.07,87.27 67.82,87.52
+5V  (via drill 0.6 pad 1.68, 0.7 pad 1.68)
  Top 0.406: 54.87,85.49 46.6,85.49 46.6,85.6 44.8,85.6 v44.8,88.7
  Top 0.61: Q7.1 66.55,38.09 66.55,31.13 65.28,29.86 63.25,29.86 | Q6.1 62.04,38.31 61.47,37.74 61.47,29.86 | Q15.1 51.56,38.6 | 51.56,38.6 51.56,38.24 | Q14.1 39.88,37.84 39.88,31.13 41.15,29.86 45.21,29.86 | 63.25,29.86 61.47,29.86 | 56.39,29.86 51.06,29.86 | 51.06,29.86 45.21,29.86 | Q5.1 56.39,38.09 56.39,29.86 | 51.56,38.6 51.06,38.09 51.06,29.86 | Q2.1 45.21,37.59 45.21,29.86 | Q4.1 43.44,75.99 43.44,84.22 44.71,85.49 49.28,85.49 | 49.28,85.49 54.87,85.49 | 54.87,85.49 59.69,85.49 | 59.69,85.49 64.77,85.49 | 64.77,85.49 68.58,85.49 69.85,84.22 69.85,76.09 69.18,75.41 Q17.1 | 64.77,85.49 64.77,75.43 64.5,75.16 Q8.1 | Q18.1 59.69,75.73 59.69,85.49 | Q19.1 54.87,76.24 54.87,85.49 | Q3.1 49.28,76.24 49.28,85.49 | 56.39,29.86 61.47,29.86 | v63.35,27.62 63.25,27.72 63.25,29.86
  Bottom 0.406: D4.A 57.36,100.83 45.06,100.83 | 55.24,15.7 55.24,15.69 63.35,15.69
  Bottom 0.61: v44.8,88.7 45.06,88.96 45.06,100.83
  Bottom 0.813: D3.A 110.6,100.83 | D2.A 23.42,100.92 23.42,100.83 | D4.A 58.07,101.13 58.07,100.83 | D5.A | 63.35,15.69 v63.35,27.62 | D6.A 22.7,15.7 22.71,15.69 | D1.A 108.66,15.7 108.66,15.69
  Bottom 1.422: S5V.1 91.14,32.35 114.86,32.35 116.79,30.42 116.79,17.21 115.27,15.7 D1.A 55.24,15.7 D5.A | D5.A 22.72,15.7 22.71,15.69 14.48,15.69 8.59,21.58 8.59,94.23 15.8,101.44 D2.A | 23.42,100.83 23.92,101.33 D4.A D3.A
ADC  (via drill 0.6 pad 1.68)
  Top 0.254: IC1.10 46,54.02 45.11,53.13 v44.3,53.13
  Top 0.61: v72.7,40.58 72.78,40.67 82.22,40.67 R24.1
  Bottom 0.61: v44.3,53.13 59.44,53.13 61.47,51.1 | v72.7,40.58 71.02,40.58 67.46,44.14 C14.1 66.48,45.37 65.69,46.17 65.69,46.88 61.47,51.1 | R25.2 61.47,51.1
CONN
  Top 0.61: 31.65,37.94 31.65,58.46 29.98,60.14 U1.32 | LED_CONN.A 30.48,36.77 31.65,37.94 | 31.65,37.94 33.15,39.44 1K.2
GND  (via drill 0.5 pad 1.68, 0.5 pad 1.93, 0.6 pad 1.68)
  Top 0.254: IC1.8 49.34,55.01 46.74,55.01 46.48,55.26 | 51.6,61.57 IC1.47 51.6,61.6 | 51.6,61.57 50.29,62.88 49.62,63.53 | 63.25,63.39 63.25,60.6 63.15,60.49 63.15,62.73 | 59.4,58.02 60.2,58.82 61.47,58.82 61.52,58.87 60.3,58.87 59.45,58.02 | 59.4,58.02 IC1.35 59.45,58.02 | 58.68,49.67 58.69,49.67 C4.2 | 56.9,49.67 58.68,49.67 | 58.68,49.67 58.93,49.42 58.93,48.4 59.18,48.15 59.18,49.12 58.68,49.62 56.95,49.62 56.9,49.67 | 41.39,57.31 41.66,57.04 | 51.6,61.6 49.5,63.7 | 51.6,61.57 51.6,61.6 | IC1.23 56.1,50.47 56.9,49.67 | 59.4,58.02 59.45,58.02 | 63.15,62.73 63.15,63.3 C3.2 | 63.15,62.73 63.86,63.44 67.62,63.44
  Top 0.305: 46.48,55.26 44.71,55.26 | 61.52,58.87 63.15,60.49
  Top 0.406: 44.71,55.26 42.93,57.04 41.66,57.04 39.88,57.04 39.39,56.55 C2.2 39.68,54.97 | C9.1 41.39,57.31 | 22.61,35.5 22.71,35.4 32.77,35.4 35.41,38.04 35.41,42.92 35.05,43.27 S5.1 39.68,49.29 39.68,54.5 | 67.62,63.44 68.23,63.44 69.14,64.36 69.14,66.89 70.26,68.01 83.67,68.01 84.48,67.2 84.48,66.22 R17.2 | 48.1,68.5 47.04,68.5 C7.2 | 39.68,54.5 39.68,54.97 | 39.68,54.97 39.68,55.41 39.37,55.72 39.37,54.8 39.68,54.5 | 39.68,54.5 39.47,54.27 37.03,54.27 36.43,53.69 36.43,51.86 35.92,51.35 34.19,51.35 33.63,51.91 33.63,59.22 33.9,59.49 C8.2 | v59.39,44.24 59.39,47.95 arc90 59.18,48.15
  Top 0.61: C1.2 49.62,63.53 | C3.2 67.55,63.41 v67.57,63.39 | R17.2 R16.2 R14.2 | R15.2 R14.2 | R13.2 84.52,53.48 | 84.52,53.48 R14.2 | C8.2 31.87,61.87 v31.24,61.66 31.19,62.12 30.74,62.12 30.33,62.53 30.33,65.47 31.04,66.18 37.34,66.18 38.8,67.64 38.8,70.7 | v30.48,73.75 32.01,75.23 32.01,81.3 30.87,82.44 20.07,82.44 14.99,87.52 | 49.5,63.7 49.5,67.1 48.1,68.5 41,68.5 38.8,70.7 | 38.8,70.7 38.8,76.1 37.6,77.3 37.6,84.9 38.4,85.7 41.2,85.7 42.1,86.6 42.1,90.1 43,91 47.6,91 47.91,90.69 47.91,89.25 48.81,88.35 R21.2 51.83,87.32 63.96,87.32 65.89,89.25 78.89,89.25 79.76,88.38 v79.76,87.01 | 14.38,45.05 15.16,45.05 U1.13 15.28,45.1 28.96,45.1 28.92,45.14 U1.22 26.99,43.89 U1.21 26.99,42.12 26.06,41.19 22.81,41.19 22.6,40.98 R39.2 22.61,39.9 R34.2 22.61,35.5 21.8,34.69 17.53,34.69 14.99,32.15 R18.2 14.97,29.77 R40.1 | LED3V.C 82.33,25.04 89.46,25.04 90.71,26.29 LED5V.C 91.41,28.27 R22.2 100.16,28.19 101.96,28.19 103.08,27.07 103.08,21.48 101.65,20.06 | R20.2 48.7,27.58 58.98,27.58 59.79,26.76 59.79,25.65 61.93,23.51 74.63,23.51 78.08,20.06 101.65,20.06 | 14.99,87.52 8.89,87.52 8.59,87.22 | 14.99,87.52 R19.2 | R14.2 84.52,83.69 88.55,87.72 91.19,87.72 92.81,89.35 92.81,101.24 92.92,101.34 | v90.36,53.69 84.72,53.69 84.52,53.48 | R23.2 102.58,87.93 104.29,87.93 105.11,88.74 105.11,95.34 104.6,95.85 v103.69,97.17 | 101.65,20.06 101.14,19.55 v101.14,18.43
  Top 0.813: v103.69,97.17 103.69,101.34
  Top 1.016: v101.14,18.43 101.14,17.42 99.52,15.79 49.94,15.79 | 49.94,15.79 15.8,15.79 | 15.8,15.79 13.97,15.79 8.59,21.18 8.59,87.22 8.59,94.33 15.6,101.34 16.41,101.34 | 16.41,101.34 50.14,101.34 | 50.14,101.34 92.92,101.34 103.69,101.34 113.64,101.34 119.13,95.85 119.13,85.39 | 119.13,85.39 119.13,74.01 U$1.P$NEG | v50.14,97.88 50.14,101.34 | v16.41,98.39 16.41,101.34 | v15.8,17.92 15.8,15.79 | v47.7,18.64 47.7,15.89 49.94,15.79 | v117.3,85.08 117.6,85.39 119.13,85.39
  Bottom 0.406: R27.1 79.82,86.69 79.76,86.76 v79.76,87.01 | C5.- 41.05,48 33.99,48 32.06,49.93 32.06,57.65 38.05,63.64 38.05,70.35 | v59.39,44.24 59.39,47.79 60.1,48.51 | 60.1,48.51 62.33,48.51 64.26,46.58 64.26,45.76 71.27,38.75 74.32,38.75 74.93,39.36 74.93,41.9 74.42,42.41 71.17,42.41 69.55,44.03 69.55,45.76 70.26,46.47 | 70.26,46.47 70.41,46.63 C15.- | IC2.1 84.85,45.01 | 85.3,52.98 85.19,52.98 85.19,53.69 81.74,57.14 81.74,64.76 85.5,68.52 85.5,70.96 86.51,71.97 | C14.2 69.36,47.37 70.26,46.47 | R37.1 55.08,48.51 60.1,48.51 | 52.28,22.62 JP2.1
  Bottom 0.61: C6.- v67.57,63.39 | v31.24,61.66 33.28,63.39 33.28,70.65 32.26,71.67 | R26.1 88.95,84.18 R28.1 93.13,84.18 94.74,85.79 | 94.74,85.79 94.74,91.99 92.61,94.12 SV13.20 SV13.18 SV13.16 SV13.14 SV13.12 SV13.10 SV13.8 SV13.6 SV13.4 | 76.19,46.63 C16.2 72.41,46.36 C15.- 78.49,52.98 85.19,52.98 | SKEYBT.3 38.25,29.1 38.25,24.93 37.14,23.82 29.82,23.82 28.91,24.73 28.91,27.17 27.59,28.49 20.98,28.49 20.06,27.57 JP1.2 JP1.1 | C13.2 98.25,71.18 | 98.25,71.18 C10.2 | 98.25,71.18 98.2,71.23 98.2,72.18 98.05,72.03 IC3.2 94.34,71.97 86.51,71.97 85.8,72.69 85.8,76.85 88.8,79.85 C11.- 94.85,79.9 94.74,80.01 94.74,85.59 94.74,85.79 | 32.26,71.67 30.48,73.45 v30.48,73.75 | 38.05,70.35 38.05,71.06 37.44,71.67 32.26,71.67 | v90.36,53.69 90.72,53.23 C12.- | 84.85,45.01 86.11,46.27 86.11,51.86 85.3,52.67 85.3,52.98 | C21.2 50.97,21.9 51.41,22.34 | C18.2 103.9,21.16 103.89,21.18 | C20.2 17.73,19.85 17.68,19.91 | C17.2 18.7,97.11
  Bottom 0.813: JP3.1 JP3.2 105.82,25.73 105.82,23.11 103.89,21.18 v101.14,18.43 | C12.- 97.69,50.03 97.69,48.4 98.5,47.59 105.11,47.59 105.36,47.84 | 105.36,47.84 109.45,51.94 DC.1 | X1.1 114.39,37.23 108.36,37.23 105.36,40.23 105.36,47.84 | 114.45,83.05 112.02,85.49 94.85,85.49 arc-90 94.74,85.59
  Bottom 1.016: JP6.1 JP6.2 108.5,93.88 107.44,94.94 106.73,94.94 | JP5.1 JP5.2 55.26,94.29 54.21,95.34 53.29,95.34 | JP4.1 JP4.2 21.06,93.72 19.84,94.94 18.95,94.94 | JP1.1 20.06,22.29 17.73,19.96 17.68,19.91 v15.8,17.92 | JP2.1 JP2.2 52.67,23.6 51.41,22.34 v47.7,18.64 | BATTERY.1 116.58,85.08 v117.3,85.08 | 18.95,94.94 18.85,94.94 16.41,97.38 v16.41,98.39 | 18.7,97.11 18.95,96.85 18.95,94.94 | 53.29,95.34 51.56,95.34 50.14,96.77 v50.14,97.88 | C22.2 53.31,95.36 53.29,95.34 | 106.73,94.94 104.7,94.94 103.79,95.85 103.79,97.07 v103.69,97.17 | C19.2 106.65,95.02 106.73,94.94
  Bottom 1.676: DC.1 109.78,51.88 109.78,51.15 102.06,58.87 102.06,62.63 105.31,65.88 105.31,75.63 112.73,83.05 112.73,83.15 114.35,83.15 arc-90 114.45,83.05 | BATTERY.1 112.93,82.95
  pour Bottom (isolate 0.61): -2.39,119.63 123.4,119.83 123.4,-2.09 -1.57,-2.09
  pour Top (isolate 0.61): -2.74,119.93 123.45,119.73 123.45,-1.74 -1.52,-1.74
JTCK  (via drill 0.6 pad 1.68)
  Top 0.254: IC1.37 56.64,60.31 56.64,60.85 56.9,61.1 57.66,61.1 v58.17,60.6
  Top 0.406: v77.22,75.17 77.22,78.48 75.9,79.79 75.9,81.89 77.47,83.46 v77.47,86.76
  Bottom 0.406: v58.17,60.6 58.93,59.83 61.72,59.83 62.99,61.1 62.99,62.12 64.77,63.9 64.77,67.2 66.55,68.98 72.14,68.98 74.93,71.77 74.93,73.96 77.22,73.96 | SV13.9 77.98,87.27 v77.47,86.76 | R29.1 79.57,72.28 78.49,72.28 78.23,72.53 78.23,73.45 77.73,73.96 77.22,73.96 | 77.22,73.96 v77.22,75.17
JTDI  (via drill 0.6 pad 1.68)
  Top 0.254: IC1.38 56.1,60.24 56.1,61.29 56.9,62.12 59.95,62.12 v60.35,61.61
  Top 0.406: v72.9,86.5 72.9,78.38 73.92,77.36 v74.68,77.36
  Bottom 0.406: v60.35,61.61 61.72,61.61 61.98,61.87 61.98,62.88 63.76,64.66 63.76,67.71 66.04,69.99 71.63,69.99 73.92,72.28 73.92,76.6 v74.68,77.36 74.68,77.14 78.01,77.14 R31.1 79.57,75.58 | SV13.5 v72.9,86.5
JTDO  (via drill 0.6 pad 1.68)
  Top 0.254: IC1.39 55.6,61.84 56.9,63.14 59.48,63.14 v60.19,63.94
  Top 0.406: v83.82,87.01 83.82,84.47 81.24,81.89 79.15,81.89 77.77,80.51 v77.77,80.41
  Bottom 0.406: v60.19,63.94 60.8,63.94 62.49,65.62 62.49,67.96 65.79,71.26 71.38,71.26 72.9,72.79 72.9,78.17 73.62,78.88 77.77,78.88 | SV13.13 83.82,90.82 v83.82,87.01 | R33.1 79.57,78.88 77.77,78.88 | 77.77,78.88 v77.77,80.41
JTMS  (via drill 0.6 pad 1.68)
  Top 0.254: IC1.34 59.92,57.52 60.45,58.06 62.23,58.06 | 64.77,60.6 v64.77,60.85
  Top 0.305: 62.23,58.06 64.77,60.6
  Top 0.406: v75.44,84.48 75.44,83.46 74.93,82.95 74.93,79.49 76.2,78.22 76.2,76.5 75.44,75.74 75.44,73.3 76.2,72.53 v76.66,72.33
  Bottom 0.406: v64.77,60.85 66.04,62.12 66.04,67.2 66.8,67.96 72.39,67.96 74.68,70.25 76.2,70.25 | 76.2,70.25 76.52,70.25 R30.1 | SV13.7 v75.44,84.48 | v76.66,72.33 76.66,70.4 76.2,70.25
KEY  (via drill 0.6 pad 1.68)
  Top 0.61: U1.34 28.14,63.24 25.86,63.24 24.89,64.2 24.89,67.76 27.58,70.45 v29.83,70.45
  Bottom 0.61: SKEYBT.2 33.43,32.76 31.38,34.81 18.27,34.7 15.5,37.48 15.5,64.91 21.03,70.45 v29.83,70.45
LED1
  Top 0.254: IC1.11 47.37,53.52 45.21,51.36
  Top 0.356: 45.21,51.36 45.21,49.17
  Top 0.61: 45.21,49.17 42.42,46.37 39.12,46.37 36.58,43.83 36.58,37.74 33.07,34.23 24.08,34.23 22.86,33.01 19.05,33.01 16.92,30.88 16.92,23.16 15.72,21.95 LED_LEG1.A
LED2  (via drill 0.6 pad 1.68)  (1 unrouted)
  Top 0.254: IC1.12 48.56,53.02
  Top 0.305: 48.56,53.02 46.84,51.3 v46.84,50.28
  Top 0.61: 35.6,69.68 35.6,75.2 33.66,77.14 33.66,82.25 31.95,83.96 21.85,83.96 17,88.81 17,94 16.05,94.95 LED_LEG2.A
  Bottom 0.61: v46.84,50.28 46.48,49.67 46.48,48.66 43.69,45.86 33.02,45.86 30.99,47.9 30.99,58.06 35.56,62.63 35.56,69.64 v35.61,69.69
LED3
  Top 0.203: 51.08,50.72 51.09,51.19 IC1.13
  Top 0.254: 51.08,50.72 50.8,50.44 48.72,50.44 48.31,50.03 48.31,49.12 47.91,48.71 46.79,48.71 46.74,48.66
  Top 0.61: 46.74,48.66 42.93,44.85 39.63,44.85 37.85,43.07 37.85,24.02 40.9,20.97 47.28,20.97 LED_LEG3.A
LED4  (via drill 0.6 pad 1.68)
  Top 0.254: IC1.14 51.59,51.26 51.59,50.05 50.45,48.91 v49.83,48.91 | LED_LEG4.A 50.58,95.14 50.55,95.14
  Top 0.61: 50.55,95.14 50.29,94.89 48.26,94.89 48.05,94.9 43.2,94.9 40.3,92 40.3,88 39.6,87.3 37,87.3 35.2,85.5 35.2,78 37.3,75.9 37.3,68.38 36.53,67.61 30.18,67.61 v29.77,68.01
  Bottom 0.61: v29.77,68.01 29.21,67.35 29.21,47.39 32.26,44.34 44.71,44.34 49.28,48.91 v49.83,48.91
LED5
  Top 0.254: IC1.15 52.1,51.29 52.1,49.27
  Top 0.305: 46.48,46.63 50.09,46.63 51.56,48.1 51.56,48.73 52.1,49.27
  Top 0.356: 46.48,46.63 43.69,43.83 40.39,43.83 38.86,42.31 38.86,30.62
  Top 0.406: 38.86,30.62 40.64,28.85 60.76,28.85
  Top 0.61: LED_LEG5.A 100.08,21.99 99.95,22.11 99.57,21.73 78.87,21.73 75.31,25.29 62.38,25.29 61.52,26.15 61.52,28.08 60.76,28.85
LED6  (via drill 0.6 pad 1.68)
  Top 0.254: IC1.16 52.6,50.31 52.73,50.18 52.73,48.05
  Top 0.305: 52.73,48.05 49.79,45.1 v48.26,45.1
  Top 0.61: v70.53,51.5 71.83,51.5 74.47,48.86 85.68,48.86 88.06,51.25 91.19,51.25 92.2,52.27 92.2,55.41 90.88,56.73 88.85,56.73 87.02,58.56 87.02,82.54 89.56,85.08 91.59,85.08 94.54,88.03 94.54,92.3 97.2,94.95 LED_LEG6.A
  Bottom 0.406: v48.26,45.1 49.28,45.1 51.82,47.64 51.82,50.18 50.04,51.96 45.87,51.96 45.37,51.45 43.23,51.45 42.67,52.01 42.67,53.74 42.17,54.25 35.82,54.25 35.05,55.01 35.05,56.53 35.82,57.29 60.2,57.29 66.8,50.69 69.34,50.69 70.16,51.5 v70.53,51.5
LED_BAT1
  Top 0.254: IC1.29 58.41,55.02 58.42,55.01 60.96,55.01 61.22,54.75 64.01,54.75 64.77,53.99
  Top 0.305: 64.77,53.99 69.6,53.99
  Top 0.61: LED_BAT1.A 74.64,53.99 69.6,53.99
LED_BAT2
  Top 0.254: IC1.30 61.47,55.52
  Top 0.305: 61.47,55.52 61.57,55.41 68.23,55.41 arc-90 68.18,55.47
  Top 0.61: LED_BAT2.A 76.96,54.75 76.25,55.47 68.18,55.47
LED_BAT3
  Top 0.254: IC1.31 61.34,56.02 61.47,56.15 67.06,56.15 | 67.69,56.79 67.95,56.79
  Top 0.406: 67.06,56.15 67.69,56.79
  Top 0.61: LED_BAT3.A 75.91,56.79 67.95,56.79
LED_BAT4
  Top 0.254: IC1.32 60.95,56.52 61.22,56.79 64.01,56.79
  Top 0.305: 64.01,56.79 64.77,57.55
  Top 0.356: 64.77,57.55 67.06,57.55
  Top 0.406: 67.06,57.55 67.82,58.31
  Top 0.61: LED_BAT4.A 77.18,62.34 74.93,60.09 68.58,60.09 67.82,59.33 67.82,58.31
LED_BAT5
  Top 0.254: IC1.33 60.43,57.02 60.83,57.42 63.12,57.42 | 64.52,58.82 64.77,58.82
  Top 0.305: 63.12,57.42 64.52,58.82
  Top 0.61: LED_BAT5.A 75.95,66.18 75.19,65.42 75.19,62.88 73.92,61.61 67.57,61.61 66.55,60.6 66.55,59.58 65.79,58.82 64.77,58.82
MODE
  Top 0.61: U1.31 29.65,58.64 30.53,57.75 30.53,40.07 29.68,39.22 LED_MODE.A
N$1
  Top 0.254: IC1.5 49.34,56.53 48.52,56.53 47.5,57.55 | C7.1 46.99,65.93 | 44.96,63.9 43.18,63.9 Q1.2
  Top 0.305: 47.5,57.55 46.74,57.55 45.72,58.56
  Top 0.356: 45.72,58.56 45.72,62.12 Q1.2
  Top 0.61: 46.99,65.93 44.96,63.9
N$2
  Top 0.254: IC1.6 48.01,56.02 47.25,56.79 | Q1.1 35.56,64.15 | C8.1 35.82,59.83
  Top 0.305: 47.25,56.79 46.23,56.79
  Top 0.356: 44.45,59.83 44.45,58.56 46.23,56.79
  Top 0.406: 35.56,64.15 37.85,61.87 | 37.85,61.87 42.42,61.87 44.45,59.83 | 35.82,59.83 37.85,61.87
N$3  (via drill 0.5 pad 1.68)
  Top 0.254: IC1.2 48.35,58.02 47.4,58.97 v47.4,59.48
  Top 0.61: 1K.1 33.48,42 33.48,47.19 38.15,51.86 v38.15,52.77
  Bottom 0.61: v38.15,52.77 38.05,52.87 34.8,52.87 33.17,54.5 33.17,57.24 35.41,59.48 v47.4,59.48
N$4
  Top 0.61: R1.2 42.42,38.35 Q14.2
N$5  (via drill 0.5 pad 1.68)
  Top 0.61: R10.1 51.82,83 v51.87,83.05
  Bottom 0.61: JP5.5 60.34,88.07 58.57,86.3 53.09,86.3 51.87,85.08 v51.87,83.05
N$6
  Top 0.61: R2.2 48.01,38.35 Q2.2
N$7  (via drill 0.5 pad 1.68)
  Top 0.61: R11.1 68.94,33.84 68.94,31.84 v68.73,31.64
  Bottom 0.61: v68.73,31.64 68.73,27.07 72.59,23.21 89.87,23.21 96.57,29.91 111.71,29.91 113.64,27.98 113.64,24.02 112.65,23.03 JP3.5
N$8  (via drill 0.5 pad 1.68)
  Top 0.61: R9.1 v57.15,82.85
  Bottom 0.61: v57.15,82.85 58.07,83.76 59.29,83.76 62.13,86.61 62.13,92.11 61.07,93.17 JP5.6
N$9  (via drill 0.5 pad 1.68)
  Top 0.61: R8.1 64.01,31.89 v63.86,31.74
  Bottom 0.61: JP3.6 110.94,27.43 110.19,28.19 97.18,28.19 90.68,21.68 71.99,21.68 65.69,27.98 65.69,29.91 v63.86,31.74
N$10
  Bottom 0.61: R25.1 54.53,51.1 R37.2
N$11  (via drill 0.5 pad 1.68)
  Top 0.61: v62.13,82.64 R12.1
  Bottom 0.61: v62.13,82.64 62.13,84.07 63.65,85.59 63.65,95.44 65.48,97.27 98.4,97.27 107.14,88.54 112.73,88.54 113.58,89.39 JP6.5
N$12
  Top 0.61: R5.2 53.6,38.6 Q15.2
N$13  (via drill 0.5 pad 1.68)
  Top 0.61: R7.1 58.93,31.59 v58.88,31.54
  Bottom 0.61: JP2.5 60.22,23.02 60.81,23.61 60.81,27.17 58.88,29.1 v58.88,31.54
N$14
  Top 0.61: R9.2 57.22,78.12 Q18.2
N$15  (via drill 0.5 pad 1.68)
  Top 0.61: v53.6,31.64 R5.1
  Bottom 0.61: JP2.6 57.75,27.59 56.64,28.69 55.22,28.69 53.6,30.32 v53.6,31.64
N$16  (via drill 0.5 pad 1.68)
  Top 0.61: v67.41,82.64 R6.1
  Bottom 0.61: v67.41,82.64 67.41,83.56 65.38,85.59 65.38,94.63 66.8,96.05 96.67,96.05 105.72,87.01 114.76,87.01 116.49,88.74 116.49,92.51 115.83,93.17 JP6.6
N$17  (via drill 0.5 pad 1.68)
  Top 0.61: R1.1 v42.42,31.64
  Bottom 0.61: v42.42,31.64 42.42,24.43 40.49,22.5 28.6,22.5 27.48,23.61 27.48,24.52 26.43,25.57 JP1.6
N$18  (via drill 0.5 pad 1.68)
  Top 0.61: v46.28,82.85 46.28,80.14 R3.1
  Bottom 0.61: JP4.6 35.25,93.17 42.52,85.89 44.35,85.89 46.28,83.96 v46.28,82.85
N$19  (via drill 0.5 pad 1.68)
  Top 0.61: v40.59,82.95 40.59,80.14 R4.1
  Bottom 0.61: JP4.5 33.42,90.63 40.59,83.46 v40.59,82.95
N$20
  Top 0.61: R10.2 51.88,78.12 Q19.2
N$21  (via drill 0.5 pad 1.68)
  Top 0.61: R2.1 v48.01,31.64
  Bottom 0.61: JP1.5 25.14,22 25.86,21.28 44.96,21.28 47.91,24.22 47.91,31.54 v48.01,31.64
N$22  (via drill 0.5 pad 1.68)
  Top 0.61: v94.44,36.31 94.44,37.74 92.61,39.56 84.38,39.56 81.94,37.13 81.94,29.78 R36.2
  Bottom 0.61: S5V.4 v94.44,36.31
N$23  (via drill 0.5 pad 1.68)
  Top 0.61: R24.2 83.06,43.41 83.06,46.98 83.57,47.49 87.53,47.49 89.56,49.52 93.22,49.52 94.95,51.25 v100.24,51.25
  Bottom 0.61: 100.24,75.43 98.42,75.43 C10.1 98.22,75.33 95.25,75.33 94.95,75.33 | R38.2 97.01,66.59 | 94.39,74.77 IC3.1
  Bottom 0.813: C11.+ 97.29,79.8 98.25,78.83 C10.1
  Bottom 1.422: 100.24,75.43 100.74,74.92 100.74,67.5 99.83,66.59 98.51,66.59 | 98.51,66.59 98.51,62.32 98.2,62.01 | 98.2,62.01 97.61,61.42 Q10.2 | 97.01,66.59 98.51,66.59 | 94.95,75.33 94.39,74.77 | v100.24,51.25 100.24,54.8 98.2,56.84 98.2,62.01
  Bottom 1.676: F3.2 99.1,75.33 95.25,75.33
N$24
  Bottom 1.422: R38.1 94.28,66.12 Q10.1
N$25
  Top 0.61: LED_MODE.C 24.42,39.22 R39.1
N$26  (via drill 0.5 pad 1.68)
  Top 0.61: LED_KEY.A 22.92,30.62 v25.66,30.62
  Bottom 0.61: v25.66,30.62 28.09,30.62 30.74,27.98 30.74,26.46 SKEYBT.4
N$27
  Top 0.61: LED_KEY.C 20.81,30.62 18.75,30.62 18.14,30.01 18.14,21.58 16.31,19.75 13.97,19.75 11.84,21.89 11.84,27.92 R40.2
N$28
  Top 0.61: R13.1 LED_BAT1.C
N$29
  Top 0.61: R18.1 LED_LEG1.C
N$30
  Top 0.61: R14.1 LED_BAT2.C
N$31
  Top 0.61: LED_LEG2.C R19.1
N$32
  Top 0.61: R15.1 LED_BAT3.C
N$33
  Top 0.406: R20.1 46.04,25.22 47.25,24.02 48.23,24.02 LED_LEG3.C
N$34
  Top 0.61: R16.1 LED_BAT4.C
N$35
  Top 0.61: LED_LEG4.C R21.1
N$36
  Top 0.61: R17.1 LED_BAT5.C
N$37
  Top 0.61: R22.1 LED_LEG5.C
N$38
  Top 0.406: LED_LEG6.C R23.1
N$39
  Bottom 0.61: C18.1 D1.C
  Bottom 0.813: JP3.4 JP3.3 108.46,23.17 D1.C
N$40
  Top 0.61: LED_CONN.C R34.1
N$41
  Bottom 0.61: S3.3V.2 S3.3V.5 C16.1 | C15.+ 72.14,44.34 76.44,44.34 C16.1 | C16.1 76.47,44.36 76.71,44.59 77.67,44.59 78.44,45.36 78.44,49.12 80.01,50.69 83.47,50.69 IC2.4
N$42
  Bottom 0.61: C13.1 97.95,69.49 94.95,69.49 | 94.95,69.49 IC3.3 | 94.9,69.44 94.95,69.49
  Bottom 0.813: C12.+ 94.28,55.99 Q10.3 | IC2.3 80.22,44.45 80.22,40.17 80.72,39.67 87.53,39.67
  Bottom 1.422: 94.9,69.44 94.8,69.33 91.9,69.33 90.38,67.81 90.38,60.29 91.79,58.88 92.01,58.88 | 92.01,58.88 87.94,54.8 87.94,40.07 87.53,39.67 87.38,39.51 87.38,36.41 S5V.5 S5V.2 | 92.01,58.88 Q10.3
N$43
  Top 0.61: Q17.2 67.28,77.95 R6.2
N$44
  Bottom 0.61: R27.2 81.79,85.3 81.79,87.77 80.52,89.04 SV13.11
N$45
  Top 0.61: R3.2 46.3,78.12 Q3.2
N$46  (via drill 0.6 pad 1.68)
  Top 0.406: R35.2 71.63,27.32 70.61,28.34 v70.61,29.1
  Bottom 0.406: S3.3V.4 71.63,31.13 70.61,30.12 v70.61,29.1
N$47
  Bottom 0.61: R26.2 88.85,88.64 88.24,89.25 88.24,91.48 SV13.17
N$48
  Bottom 0.61: SV13.19 90.68,89.96 91.59,89.04 R28.2
N$49
  Top 0.406: R35.1 LED3V.A
N$50
  Bottom 0.61: C17.1 21.32,96.82 23.58,96.82
  Bottom 0.813: D2.C 23.58,96.82 23.6,96.58 JP4.4 JP4.3
N$51
  Top 0.406: R36.1 LED5V.A
N$52  (via drill 0.5 pad 2.18)
  Top 1.676: U$1.P$POS v112.32,65.68
  Bottom 1.676: X1.2 114.41,51.02 DC.2 117.91,54.52 117.91,60.7 114.45,64.15 112.32,64.15 | 112.32,64.15 109.78,64.15 | 109.78,64.15 109.58,64.15 106.81,61.38 F3.1 | BATTERY.2 109.78,75.75 109.78,64.15 | v112.32,65.68 112.32,64.15
N$53
  Top 0.61: R4.2 40.71,78.12 Q4.2
N$54
  Top 0.61: R7.2 58.93,38.6 Q5.2
N$55
  Top 0.61: R8.2 64.01,38.6 Q6.2
N$56
  Top 0.61: R11.2 69.09,38.6 Q7.2
N$57
  Top 0.61: Q8.2 62.2,77.97 R12.2
N$58
  Bottom 0.813: D3.C 111.04,97.22 JP6.4 JP6.3
  Bottom 1.016: C19.1 D3.C
N$59
  Bottom 0.813: D4.C 57.8,97.22 JP5.4 JP5.3
  Bottom 1.016: C22.1 57.67,97.48 D4.C
N$60
  Bottom 0.61: C21.1 55.01,19.96 D5.C
  Bottom 0.813: D5.C JP2.3 JP2.4
N$61
  Bottom 0.61: C20.1 22.5,19.85 D6.C
  Bottom 0.813: JP1.4 JP1.3 D6.C
NJTRST  (via drill 0.6 pad 1.68)
  Top 0.254: IC1.40 55.09,60.24 55.09,62.32 56.9,64.15 57.11,64.15 v57.76,64.71
  Bottom 0.406: v57.76,64.71 58.38,65.42 60.2,65.42 61.22,66.44 61.22,68.47 65.28,72.53 69.85,72.53 71.88,74.57 71.88,81.17 72.65,81.93 | R32.1 72.65,81.93 | SV13.3 70.36,85.74 72.65,83.46 72.65,81.93
RST  (via drill 0.6 pad 1.68)
  Top 0.254: IC1.7 47.5,55.52 46.99,56.02 | 37.34,58.06 37.09,57.8 | 39.37,59.09 C9.2
  Top 0.305: 46.99,56.02 45.47,56.02
  Top 0.356: 35.05,56.79 36.32,58.06 37.34,58.06 38.37,58.06 C9.2 | 45.47,56.02 43.08,58.41 43.08,59.94 42.22,60.8 39.83,60.8 39.37,60.34 39.37,59.09 | 37.09,57.8 v37.09,55.72
  Top 0.406: 35.05,56.79 S5.2
  Bottom 0.61: v37.09,55.72 60,55.72 66.55,49.17 71.88,49.17 73.41,50.69 73.41,64.91 74.81,66.31 81.71,66.31 83.97,68.57 83.97,83.35 86.11,85.49 86.11,88.84 85.6,89.35 SV13.15
SERWO1
  Top 0.254: 53.34,47.39 53.34,49.93 53.6,50.18 IC1.18
  Top 0.305: 49.02,43.07 53.34,47.39
  Top 0.406: 49.02,43.07 45.21,43.07 43.94,41.8 42.59,41.8 Q14.3
SERWO2
  Top 0.254: Q2.3 46.99,41.04 | IC1.19 54.1,49.78 54,49.57 54,46.68
  Top 0.305: 54,46.68 49.63,42.31
  Top 0.406: 49.63,42.31 47.75,42.31 46.99,41.55 Q2.3
SERWO3
  Top 0.254: 54.97,48.45 54.61,48.81 54.61,51.26 IC1.20
  Top 0.305: 54.97,46.07 54.97,48.45
  Top 0.406: 54.97,46.07 54.97,45.91 52.58,43.53 Q15.3
SERWO4
  Top 0.254: IC1.41 54.6,62.87 56.14,64.41
  Top 0.305: 56.14,64.41 56.14,65.93
  Top 0.61: Q17.3 68.23,71.37 64.37,67.5 62.23,67.5 61.22,66.49 56.69,66.49 56.14,65.93
SERWO5
  Top 0.254: IC1.42 54.1,63.64 | 55.12,66.18 55.12,68.22
  Top 0.305: 54.1,63.64 55.12,64.66 55.12,66.18
  Top 0.61: Q18.3 55.12,69.91 55.12,66.18
SERWO6
  Top 0.254: IC1.43 53.6,61.87 53.34,62.12
  Top 0.305: 53.34,62.12 53.34,66.18
  Top 0.61: Q19.3 53.34,72.45 53.34,66.18
SERWO7
  Top 0.254: IC1.45 52.61,60.25 52.61,63.35 52.07,63.9
  Top 0.305: 52.07,63.9 52.07,66.18
  Top 0.61: Q3.3 48.18,72.03 49.02,72.03 52.07,68.98 52.07,66.18
SERWO8
  Top 0.254: IC1.46 52.1,62.35 50.55,63.9
  Top 0.305: 50.55,63.9 50.55,66.18
  Top 0.61: 50.55,66.18 50.55,67.96 48.26,70.25 43.18,70.25 41.66,71.77 Q4.3
SERWO9
  Top 0.254: IC1.25 58.89,53.02 59.95,51.96
  Top 0.305: 59.95,51.96 61.47,51.96 63.25,50.18
  Top 0.406: 63.25,50.18 63.25,43.98 61.62,42.36 58.22,42.36 57.91,42.05 Q5.3
SERWO10
  Top 0.254: IC1.26 59.4,53.52 60.2,52.72
  Top 0.305: 60.2,52.72 62.23,52.72 65.28,49.67
  Top 0.406: Q6.3 65.28,43.15 65.28,49.67
SERWO11
  Top 0.254: IC1.27 59.92,54.02 60.45,53.48 | 68.07,41.55 Q7.3
  Top 0.305: 60.45,53.48 62.74,53.48 66.8,49.42
  Top 0.406: 68.07,41.55 66.8,42.82 66.8,49.42
SERWO12  (via drill 0.6 pad 1.68)
  Top 0.254: IC1.28 60.43,54.52 60.83,54.12 63.38,54.12 64.26,53.23 65.53,53.23
  Top 0.305: 65.53,53.23 66.3,52.47 v67.82,52.47
  Top 0.61: v57.36,68.39 57.63,68.39 59.89,70.65 61.83,70.65 63.15,71.97 Q8.3
  Bottom 0.61: v67.82,52.47 67.31,52.47 61.22,58.56 55.37,58.56 54.36,59.58 54.36,66.74 55.93,68.32 57.29,68.32 v57.36,68.39
USART_RX  (via drill 0.5 pad 1.68)
  Top 0.254: 55.83,48.71 55.86,48.68 | 55.86,43.86 v55.42,43.22 | IC1.21 55.1,49.44 55.83,48.71 | 55.83,48.71 55.83,43.63 v55.42,43.22 | 55.42,43.17 v55.42,43.22
  Top 0.305: 55.86,48.68 55.86,43.86
  Top 0.61: U1.2 13.64,61.64 12.5,60.5 12.5,41.14 13.67,39.97 v19.31,39.97
  Bottom 0.61: v55.42,43.22 55.02,43.22 53.6,41.8 21.13,41.8 v19.31,39.97
USART_TX  (via drill 0.5 pad 1.68)
  Top 0.254: IC1.22 55.6,50.01 57.25,48.35 | 57.25,46.98 v57.51,46.52
  Top 0.305: 57.25,48.35 57.25,46.98
  Top 0.61: U1.1 12.55,63.14 10.92,61.51 10.92,38.45 12.25,37.13 19.26,37.13 v19.31,37.18
  Bottom 0.61: v57.51,46.52 57.51,46.22 57.3,46.02 57.3,40.73 56.24,39.67 23.73,39.67 21.24,37.18 v19.31,37.18

### Text on the board
Top: + | J. Trzyna | HEXAPOD
Bottom: J. Trzyna | HEXAPOD